# EasyEDA schematic ugs wifi pendant easyeda source.json
TITLE: UGS Wifi Pendant; REV: 1.0; Date: 2019-01-29; Sheet: 1/1; Drawn By: aleslukek
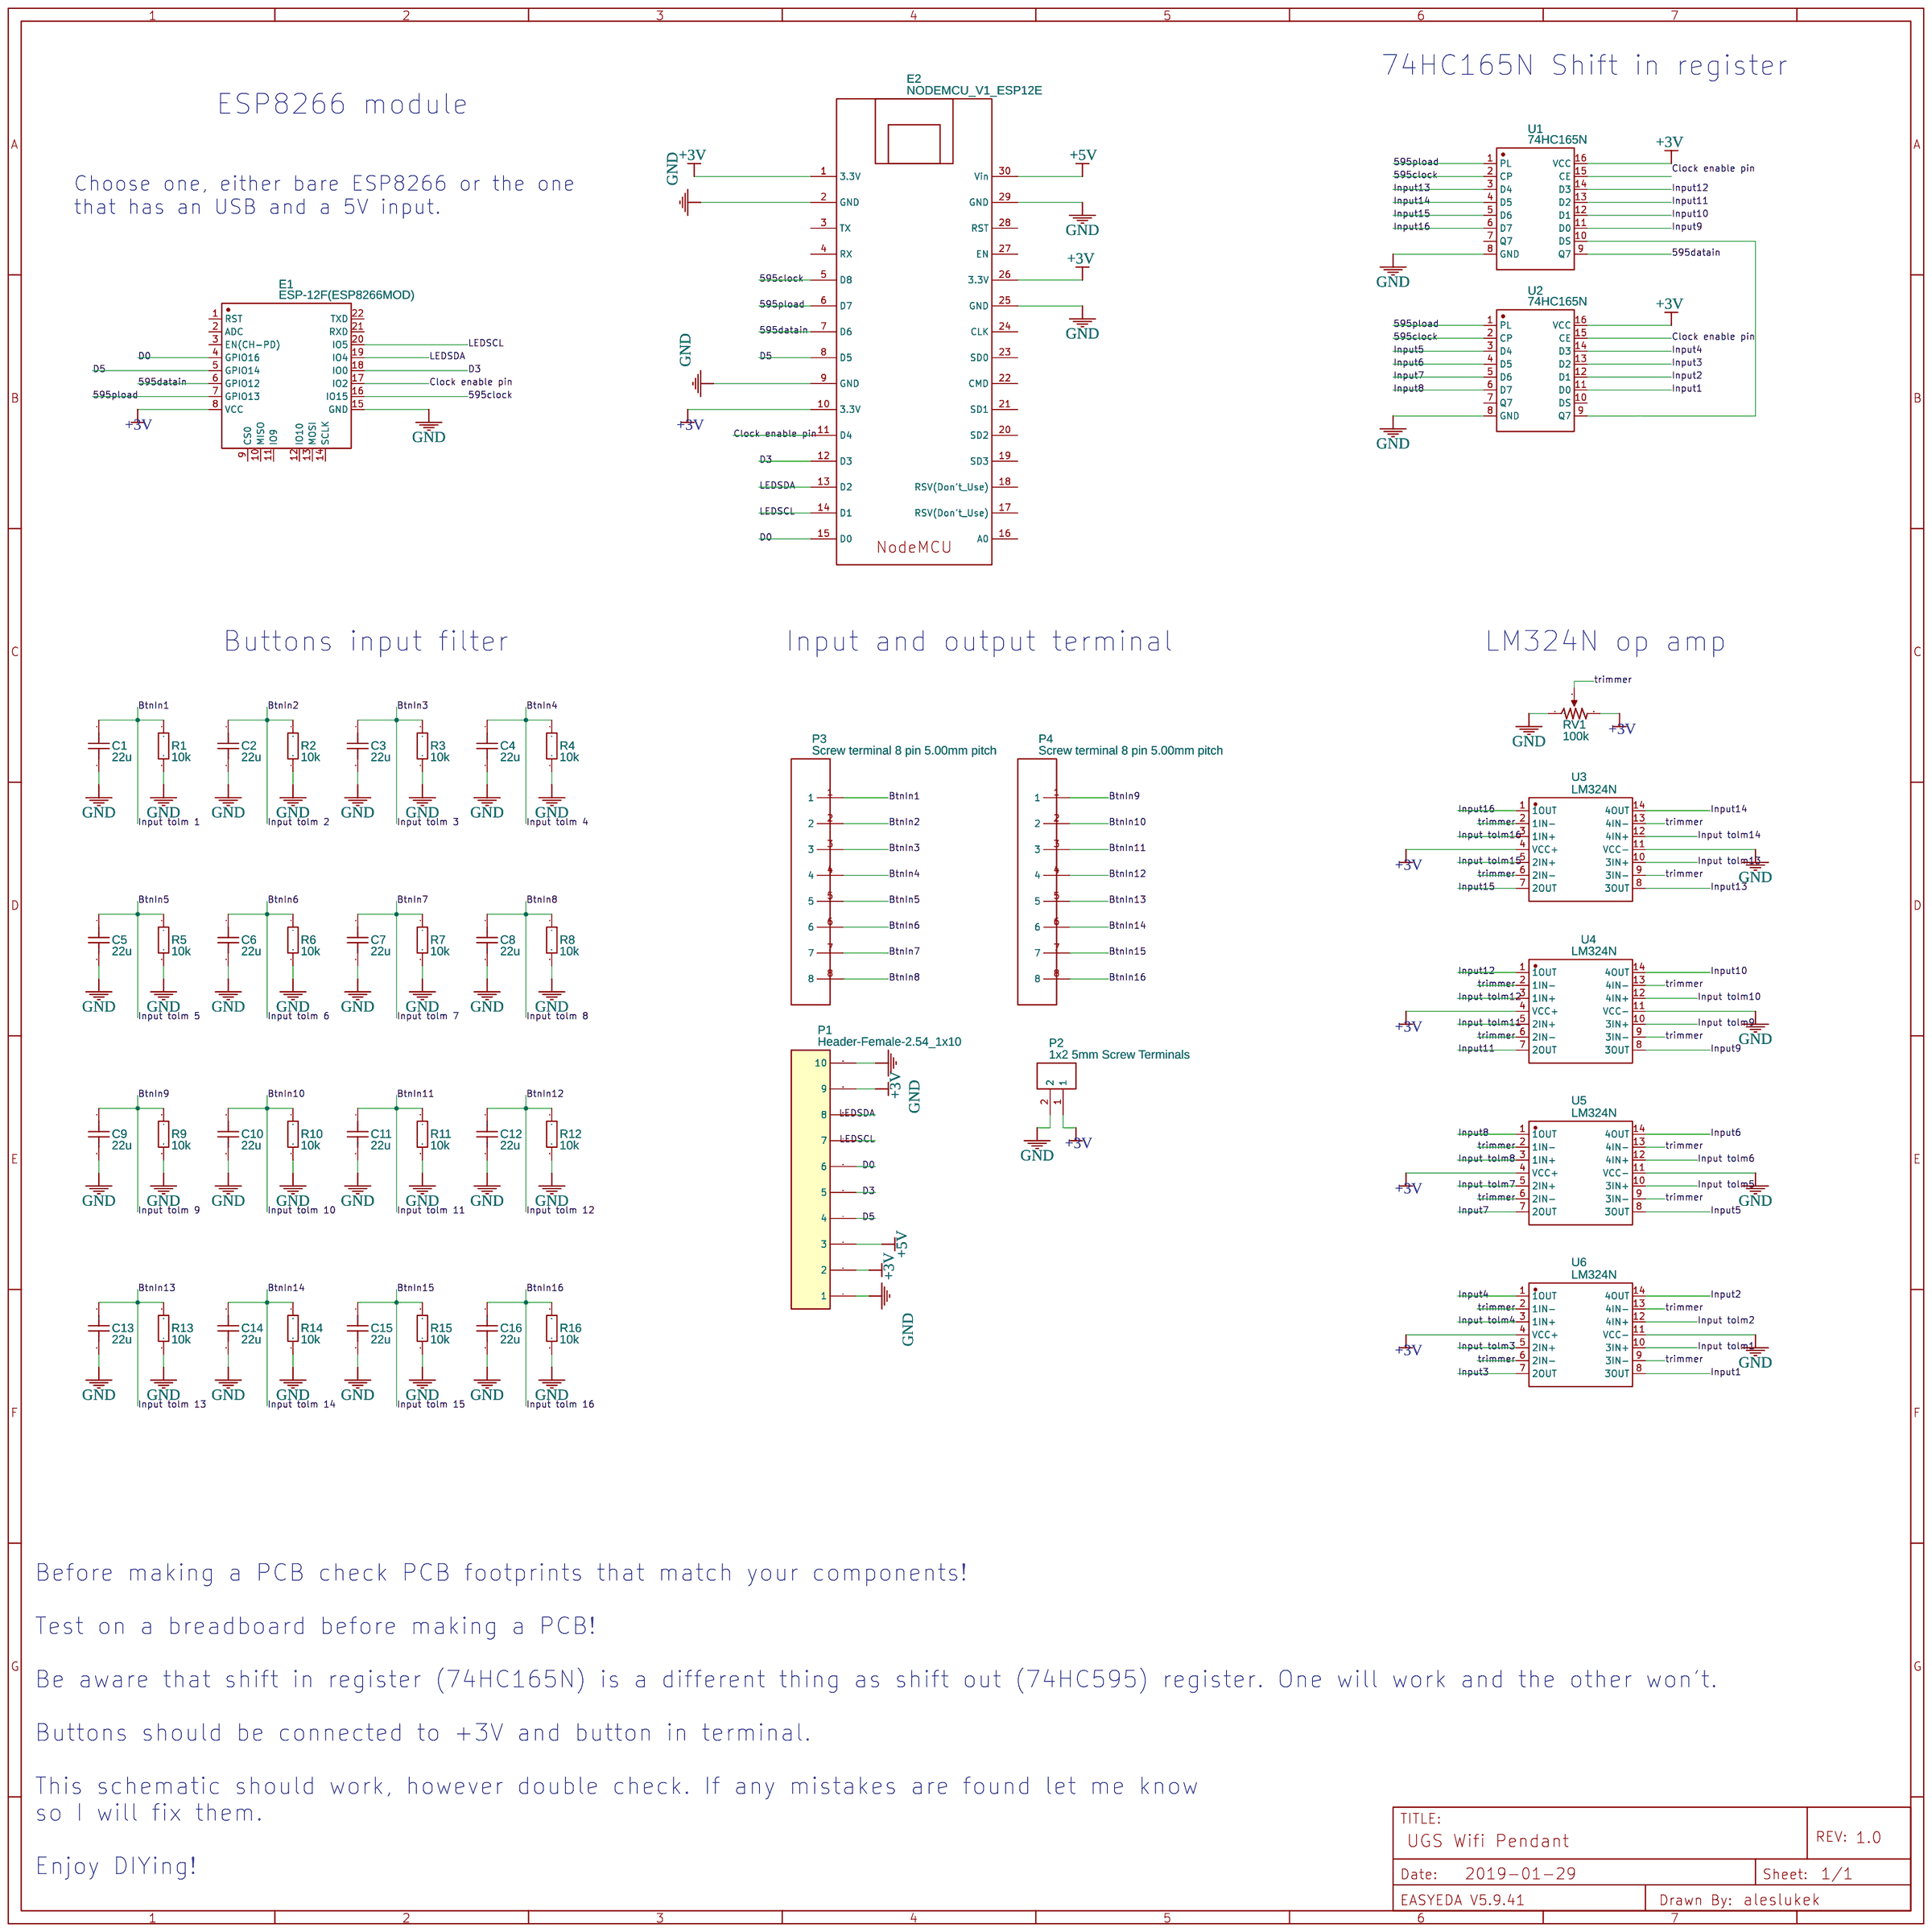
[diagram p0: schematic sheet]

## Parts
C1  22u  [RAD-0.1]
C2  22u  [RAD-0.1]
C3  22u  [RAD-0.1]
C4  22u  [RAD-0.1]
C5  22u  [RAD-0.1]
C6  22u  [RAD-0.1]
C7  22u  [RAD-0.1]
C8  22u  [RAD-0.1]
C9  22u  [RAD-0.1]
C10  22u  [RAD-0.1]
C11  22u  [RAD-0.1]
C12  22u  [RAD-0.1]
C13  22u  [RAD-0.1]
C14  22u  [RAD-0.1]
C15  22u  [RAD-0.1]
C16  22u  [RAD-0.1]
E1  ESP-12F(ESP8266MOD)  [ESP-12F(ESP8266MOD)]
E2  NODEMCU_V1_ESP12E  [ESP12E_DEVKIT-V1]
P1  Header-Female-2.54_1x10  [HDR-10X1/2.54]
P2  1x2 5mm Screw Terminals  [1X2 5MM SCREW TERMINALS]
P3  Screw terminal 8 pin 5.00mm pitch  [1X8 5MM SCREW TERMINALS]
P4  Screw terminal 8 pin 5.00mm pitch  [1X8 5MM SCREW TERMINALS]
R1  10k  [AXIAL-0.3]
R2  10k  [AXIAL-0.3]
R3  10k  [AXIAL-0.3]
R4  10k  [AXIAL-0.3]
R5  10k  [AXIAL-0.3]
R6  10k  [AXIAL-0.3]
R7  10k  [AXIAL-0.3]
R8  10k  [AXIAL-0.3]
R9  10k  [AXIAL-0.3]
R10  10k  [AXIAL-0.3]
R11  10k  [AXIAL-0.3]
R12  10k  [AXIAL-0.3]
R13  10k  [AXIAL-0.3]
R14  10k  [AXIAL-0.3]
R15  10k  [AXIAL-0.3]
R16  10k  [AXIAL-0.3]
RV1  100k  [TRIMMER]
U1  74HC165N  [DIP16]
U2  74HC165N  [DIP16]
U3  LM324N  [DIP-14]
U4  LM324N  [DIP-14]
U5  LM324N  [DIP-14]
U6  LM324N  [DIP-14]

## Library data of the parts
C1-C16 = Cap_RAD-0.1_US: Manufacturer Part: ?
E1 = -: Supplier: LCSC; Manufacturer: Ai-Thinker; Supplier Part: C82891
E2 = NODEMCU_V1_ESP12E: Contributor: canda410; sourceId: OGtr1ZXUS; Manufacturer Part: ?
P1 = -: LCSC: C35445; Supplier Part: C35445; Supplier: LCSC; Manufacturer: LCSC
P2 = -: Contributor: IDVert3X
P3 P4 U1 U2 = -: Manufacturer Part: ?
R1-R16 = Res_AXIAL-0.3(1/8W)_EU: Manufacturer Part: ?
RV1 = trimmer: Model: Potentiometer; K(%): 50; Contributor: Lexerar; Manufacturer Part: ?
U3-U6 = -: Supplier: LCSC; Manufacturer: TI; Contributor: LCSC; Supplier Part: C114380

## Nets
+3V: E1.8(VCC) E2.1(3.3V) E2.10(3.3V) E2.26(3.3V) P1.2 P1.9 P2.1 RV1.3 U1.16(VCC) U2.16(VCC) U3.4(VCC+) U4.4(VCC+) U5.4(VCC+) U6.4(VCC+)
+5V: E2.30(Vin) P1.3
GND: C1.2 C2.2 C3.2 C4.2 C5.2 C6.2 C7.2 C8.2 C9.2 C10.2 C11.2 C12.2 C13.2 C14.2 C15.2 C16.2 E1.15(GND) E2.2(GND) E2.9(GND) E2.25(GND) E2.29(GND) P1.1 P1.10 P2.2 R1.2 R2.2 R3.2 R4.2 R5.2 R6.2 R7.2 R8.2 R9.2 R10.2 R11.2 R12.2 R13.2 R14.2 R15.2 R16.2 RV1.1 U1.8(GND) U2.8(GND) U3.11(VCC-) U4.11(VCC-) U5.11(VCC-) U6.11(VCC-)
595clock: E1.16(IO15) E2.5(D8) U1.2(CP) U2.2(CP)
595datain: E1.6(GPIO12) E2.7(D6) U1.9(Q7)
595pload: E1.7(GPIO13) E2.6(D7) U1.1(PL) U2.1(PL)
BtnIn1: C1.1 P3.1 R1.1
BtnIn2: C2.1 P3.2 R2.1
BtnIn3: C3.1 P3.3 R3.1
BtnIn4: C4.1 P3.4 R4.1
BtnIn5: C5.1 P3.5 R5.1
BtnIn6: C6.1 P3.6 R6.1
BtnIn7: C7.1 P3.7 R7.1
BtnIn8: C8.1 P3.8 R8.1
BtnIn9: C9.1 P4.1 R9.1
BtnIn10: C10.1 P4.2 R10.1
BtnIn11: C11.1 P4.3 R11.1
BtnIn12: C12.1 P4.4 R12.1
BtnIn13: C13.1 P4.5 R13.1
BtnIn14: C14.1 P4.6 R14.1
BtnIn15: C15.1 P4.7 R15.1
BtnIn16: C16.1 P4.8 R16.1
Clock enable pin: E1.17(IO2) E2.11(D4) U2.15(CE)
D0: E1.4(GPIO16) E2.15(D0) P1.6
D3: E1.18(IO0) E2.12(D3) P1.5
D5: E1.5(GPIO14) E2.8(D5) P1.4
Input1: U2.11(D0) U6.8(3OUT)
Input2: U2.12(D1) U6.14(4OUT)
Input3: U2.13(D2) U6.7(2OUT)
Input4: U2.14(D3) U6.1(1OUT)
Input5: U2.3(D4) U5.8(3OUT)
Input6: U2.4(D5) U5.14(4OUT)
Input7: U2.5(D6) U5.7(2OUT)
Input8: U2.6(D7) U5.1(1OUT)
Input9: U1.11(D0) U4.8(3OUT)
Input10: U1.12(D1) U4.14(4OUT)
Input11: U1.13(D2) U4.7(2OUT)
Input12: U1.14(D3) U4.1(1OUT)
Input13: U1.3(D4) U3.8(3OUT)
Input14: U1.4(D5) U3.14(4OUT)
Input15: U1.5(D6) U3.7(2OUT)
Input16: U1.6(D7) U3.1(1OUT)
Input tolm1: U6.10(3IN+)
Input tolm2: U6.12(4IN+)
Input tolm3: U6.5(2IN+)
Input tolm4: U6.3(1IN+)
Input tolm5: U5.10(3IN+)
Input tolm6: U5.12(4IN+)
Input tolm7: U5.5(2IN+)
Input tolm8: U5.3(1IN+)
Input tolm9: U4.10(3IN+)
Input tolm10: U4.12(4IN+)
Input tolm11: U4.5(2IN+)
Input tolm12: U4.3(1IN+)
Input tolm13: U3.10(3IN+)
Input tolm14: U3.12(4IN+)
Input tolm15: U3.5(2IN+)
Input tolm16: U3.3(1IN+)
LEDSCL: E1.20(IO5) E2.14(D1) P1.7
LEDSDA: E1.19(IO4) E2.13(D2) P1.8
trimmer: RV1.2 U3.2(1IN-) U3.6(2IN-) U3.9(3IN-) U3.13(4IN-) U4.2(1IN-) U4.6(2IN-) U4.9(3IN-) U4.13(4IN-) U5.2(1IN-) U5.6(2IN-) U5.9(3IN-) U5.13(4IN-) U6.2(1IN-) U6.6(2IN-) U6.9(3IN-) U6.13(4IN-)
Net-(U1-10): U1.10(DS) U2.9(Q7)

Not connected (* = marked no-connect by the designer): E1 1(RST) 2(ADC) 3(EN(CH-PD)) 9(CS0) 10(MISO) 11(IO9) 12(IO10) 13(MOSI) 14(SCLK) 21(RXD) 22(TXD); E2 3(TX) 4(RX) 16(A0) 17(RSV(Don't Use)) 18(RSV(Don't Use)) 19(SD3) 20(SD2) 21(SD1) 22(CMD) 23(SD0) 24(CLK) 27(EN) 28(RST); U1 7(Q7) 15(CE); U2 7(Q7) 10(DS)

## Notes on the sheet
- 74HC165N Shift in register
- ESP8266 module
- Choose one, either bare ESP8266 or the one
  that has an USB and a 5V input.
- Buttons input filter
- Input and output terminal
- LM324N op amp
- Before making a PCB check PCB footprints that match your components!
  Test on a breadboard before making a PCB!
  Be aware that shift in register (74HC165N) is a different thing as shift out (74HC595) register. One will work and the other won't.
  Buttons should be connected to +3V and button in terminal.
  This schematic should work, however double check. If any mistakes are found let me know
  so I will fix them.
  Enjoy DIYing!
